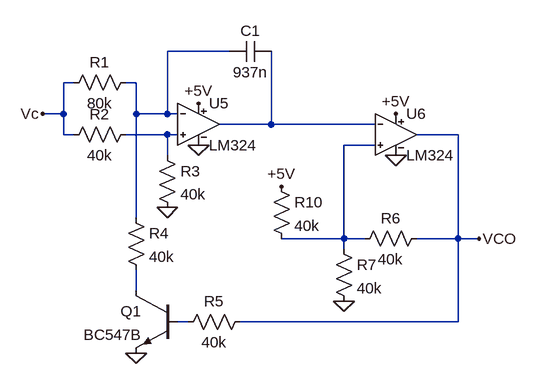
[diagram p0: schematic test.asc]
test.asc, the LTspice schematic file:
Version 4
SHEET 1 1748 772
WIRE 48 32 -48 32
WIRE -192 80 -208 80
WIRE -96 80 -112 80
WIRE -208 128 -208 80
WIRE -208 128 -240 128
WIRE -96 128 -96 80
WIRE -48 128 -48 32
WIRE -48 128 -96 128
WIRE -32 128 -48 128
WIRE 112 144 112 32
WIRE 112 144 32 144
WIRE 272 144 112 144
WIRE -208 160 -208 128
WIRE -192 160 -208 160
WIRE -48 160 -112 160
WIRE -32 160 -48 160
WIRE 400 160 336 160
WIRE 272 176 224 176
WIRE -48 192 -48 160
WIRE -96 288 -96 128
WIRE 224 320 224 176
WIRE 224 320 128 320
WIRE 256 320 224 320
WIRE 400 320 400 160
WIRE 400 320 336 320
WIRE 432 320 400 320
WIRE 224 336 224 320
WIRE -96 400 -96 368
WIRE -16 448 -32 448
WIRE 400 448 400 320
WIRE 400 448 64 448
FLAG 0 112 +5V
FLAG 304 128 +5V
FLAG -48 272 0
FLAG -96 496 0
FLAG 224 416 0
FLAG 0 176 0
FLAG 304 192 0
FLAG 128 240 +5V
FLAG -240 128 Vc
FLAG 432 320 VCO
SYMBOL cap 112 16 R90
WINDOW 0 0 32 VBottom 0
WINDOW 3 32 32 VTop 0
SYMATTR InstName C1
SYMATTR Value 937n
SYMBOL res -208 96 R270
WINDOW 0 32 56 VTop 0
WINDOW 3 0 56 VBottom 0
SYMATTR InstName R1
SYMATTR Value 80k
SYMBOL res -208 176 R270
WINDOW 0 32 56 VTop 0
WINDOW 3 0 56 VBottom 0
SYMATTR InstName R2
SYMATTR Value 40k
SYMBOL res -64 176 R0
SYMATTR InstName R3
SYMATTR Value 40k
SYMBOL res -112 272 R0
SYMATTR InstName R4
SYMATTR Value 40k
SYMBOL npn -32 400 M0
SYMATTR InstName Q1
SYMATTR Value BC547B
SYMBOL res 80 432 R90
WINDOW 0 0 56 VBottom 0
WINDOW 3 32 56 VTop 0
SYMATTR InstName R5
SYMATTR Value 40k
SYMBOL res 352 304 R90
WINDOW 0 0 56 VBottom 0
WINDOW 3 32 56 VTop 0
SYMATTR InstName R6
SYMATTR Value 40k
SYMBOL res 208 320 R0
SYMATTR InstName R7
SYMATTR Value 40k
SYMBOL res 112 224 R0
SYMATTR InstName R10
SYMATTR Value 40k
SYMBOL myLib\\LM324 0 80 R0
SYMATTR InstName U5
SYMBOL myLib\\LM324 304 96 R0
SYMATTR InstName U6

The netlist it stands for:
* test.asc
C1 N002 N001 937n
R1 Vc N001 80k
R2 Vc N003 40k
R3 N003 0 40k
R4 N001 N005 40k
Q1 N005 N006 0 0 BC547B
R5 VCO N006 40k
R6 VCO N004 40k
R7 N004 0 40k
R10 +5V N004 40k
XU5 N003 N001 +5V 0 N002 LM324  ; pins In+ In- V+ V- OUT
XU6 N004 N002 +5V 0 VCO LM324  ; pins In+ In- V+ V- OUT
.model NPN NPN
.model PNP PNP
.lib standard.bjt
.lib myLib\LM324.lib
.backanno
.end